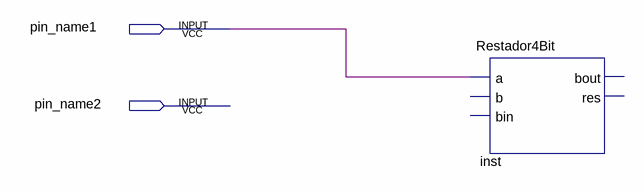
[diagram p0: schematic sheet]
// Quartus schematic Restador6Bit.bdf as structural Verilog: 1 symbols, 2 pins
module Restador6Bit (
  input  pin_name1,
  input  pin_name2
);

  Restador4Bit inst (.a(pin_name1));  // open: b, bin, bout, res
endmodule
